# EAGLE design tick-wifi-mk-1.2 (EAGLE 7.5.0)
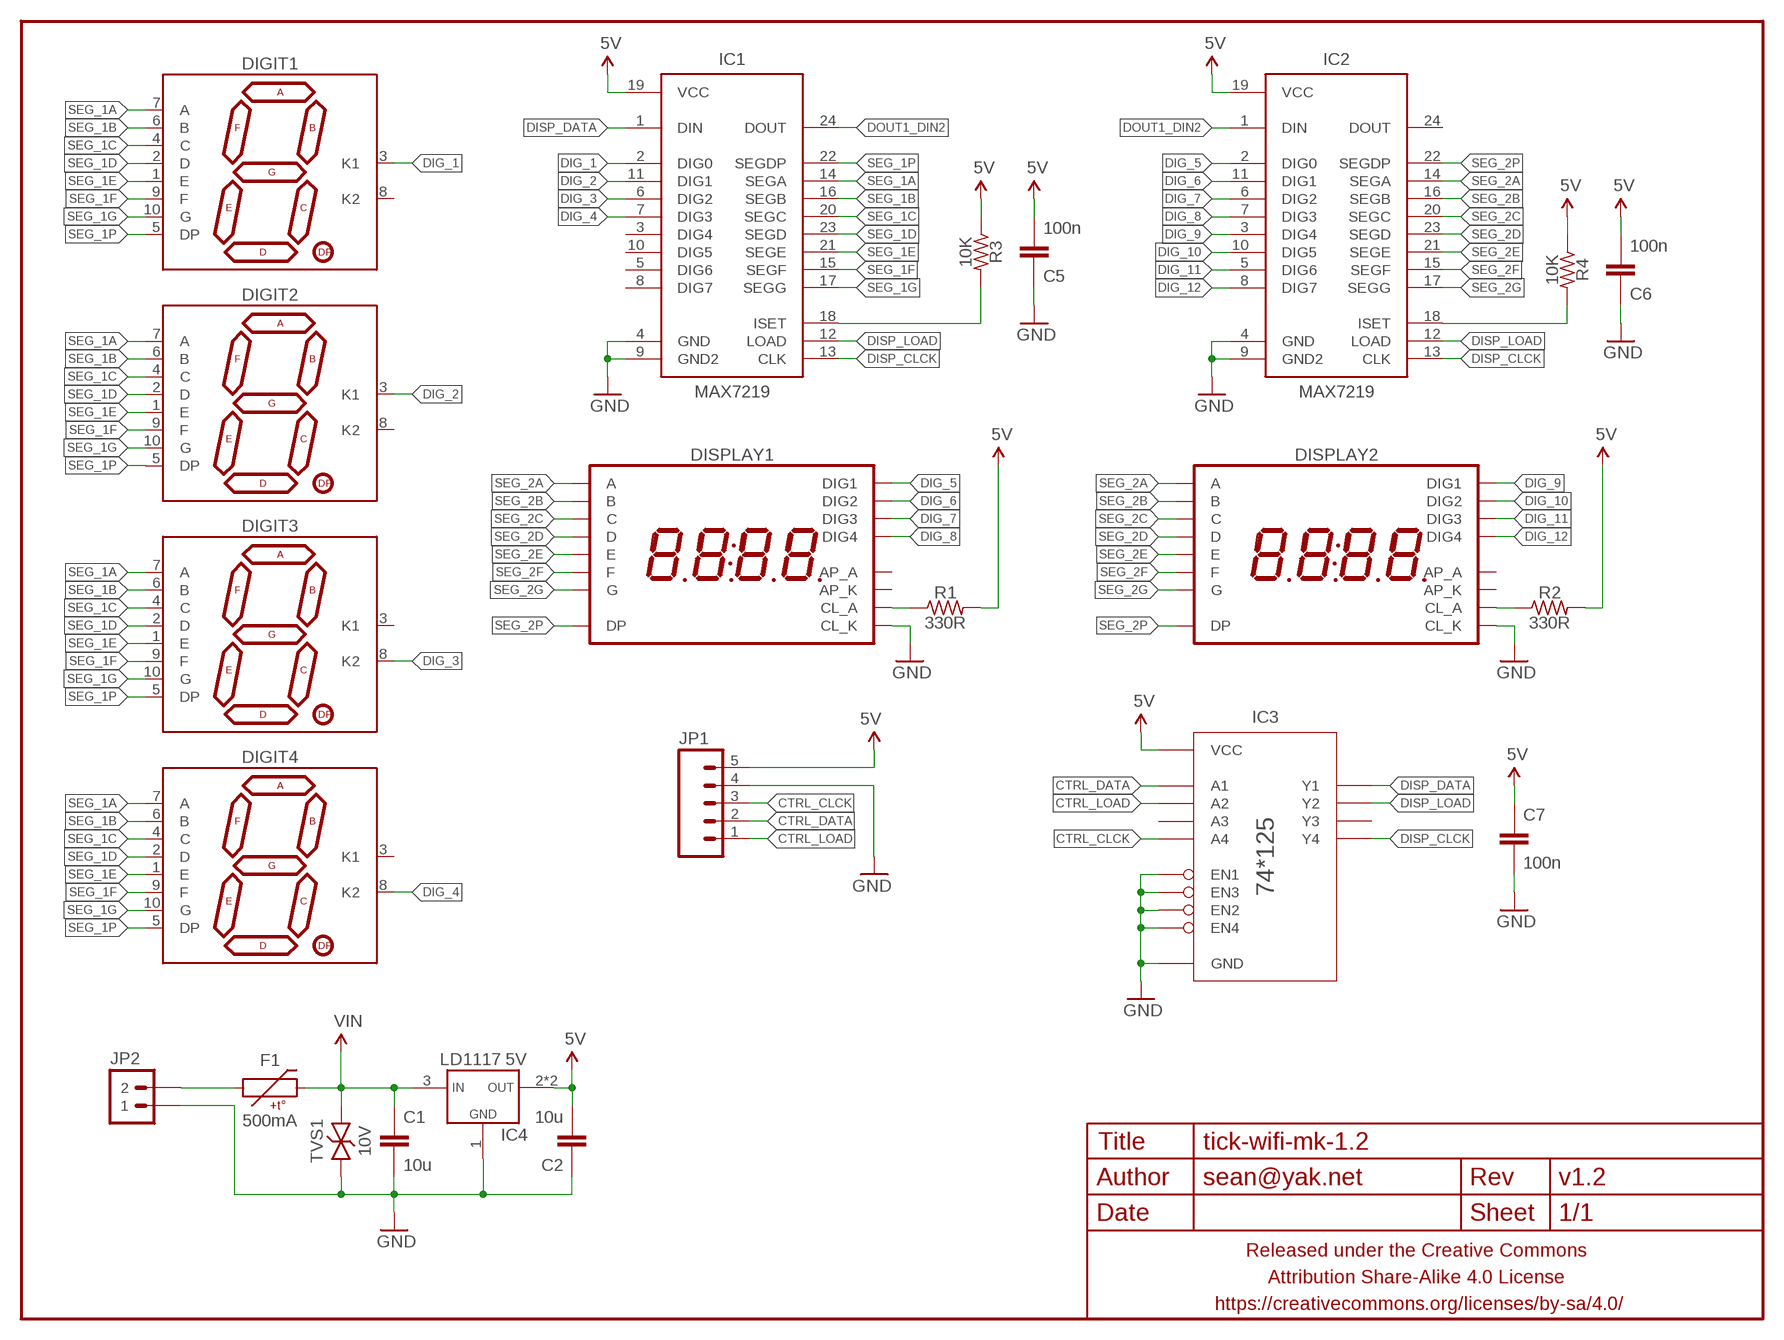
[diagram p0: schematic, sheet 1]

## Parts
C1  10u  CAPACITOR-CERAMICC1210  [C1210]
C2  10u  CAPACITOR-CERAMICC1210  [C1210]
C5  100n  CAPACITOR-CERAMICC0603  [C0603]
C6  100n  CAPACITOR-CERAMICC0603  [C0603]
C7  100n  CAPACITOR-CERAMICC0603  [C0603]
DIGIT1  7SEG_1DIGPTH-25.4MM-BARE  [7SEG_1DIG_25.4MM_NOSILK]
DIGIT2  7SEG_1DIGPTH-25.4MM-BARE  [7SEG_1DIG_25.4MM_NOSILK]
DIGIT3  7SEG_1DIGPTH-25.4MM-BARE  [7SEG_1DIG_25.4MM_NOSILK]
DIGIT4  7SEG_1DIGPTH-25.4MM-BARE  [7SEG_1DIG_25.4MM_NOSILK]
DISPLAY1  7SEG_4DIGIT_COLON_APOS  [7SEG_4DIG_10MM]
DISPLAY2  7SEG_4DIGIT_COLON_APOS  [7SEG_4DIG_10MM]
F1  500mA  PTCPTC-1210  [PTC-1210]
FRAME1  FRAME-LETTERNO_PACKAGE  [DUMMY]
IC1  MAX7219  MAX7219SOIC-W  [SO24W]
IC2  MAX7219  MAX7219SOIC-W  [SO24W]
IC3  74HC125  74125SOIC14  [SO14]
IC4  LD1117 5V  VREG_1117SOT223  [SOT223]
JP1  M05PTH-CENTERED  [1X05_PTH_CENTERED]
JP2  M02PTH-CENTERED-R+  [1X02-CENTER-R+]
R1  330R  RESISTORR0603  [R0603]
R2  330R  RESISTORR0603  [R0603]
R3  10K  RESISTORR0603  [R0603]
R4  10K  RESISTORR0603  [R0603]
TVS1  10V  TVSSMA  [SMA-DIODE-TVS-BIDIR]

## Nets
5V: C2.2 C5.2 C6.2 C7.1 IC1.19(VCC) IC2.19(VCC) IC3.14(VCC) IC4.2(VOUT) IC4.4(VOUT) JP1.5 R1.2 R2.2 R3.1 R4.1
CTRL_CLCK: IC3.12(A4) JP1.3
CTRL_DATA: IC3.2(A1) JP1.2
CTRL_LOAD: IC3.5(A2) JP1.1
DIG_1: DIGIT1.3(K1) IC1.2(DIG0)
DIG_2: DIGIT2.3(K1) IC1.11(DIG1)
DIG_3: DIGIT3.8(K2) IC1.6(DIG2)
DIG_4: DIGIT4.8(K2) IC1.7(DIG3)
DIG_5: DISPLAY1.1(DIG1) IC2.2(DIG0)
DIG_6: DISPLAY1.2(DIG2) IC2.11(DIG1)
DIG_7: DISPLAY1.6(DIG3) IC2.6(DIG2)
DIG_8: DISPLAY1.8(DIG4) IC2.7(DIG3)
DIG_9: DISPLAY2.1(DIG1) IC2.3(DIG4)
DIG_10: DISPLAY2.2(DIG2) IC2.10(DIG5)
DIG_11: DISPLAY2.6(DIG3) IC2.5(DIG6)
DIG_12: DISPLAY2.8(DIG4) IC2.8(DIG7)
DISP_CLCK: IC1.13(CLK) IC2.13(CLK) IC3.11(Y4)
DISP_DATA: IC1.1(DIN) IC3.3(Y1)
DISP_LOAD: IC1.12(LOAD) IC2.12(LOAD) IC3.6(Y2)
DOUT1_DIN2: IC1.24(DOUT) IC2.1(DIN)
GND: C1.2 C2.1 C5.1 C6.1 C7.2 DISPLAY1.12(CL_K) DISPLAY2.12(CL_K) IC1.4(GND) IC1.9(GND2) IC2.4(GND) IC2.9(GND2) IC3.1(EN1) IC3.4(EN2) IC3.7(GND) IC3.10(EN3) IC3.13(EN4) IC4.1(GND) JP1.4 JP2.1 TVS1.1
N$1: F1.1 JP2.2
N$2: IC2.18(ISET) R4.2
N$3: DISPLAY1.4(CL_A) R1.1
N$4: IC1.18(ISET) R3.2
N$5: DISPLAY2.4(CL_A) R2.1
SEG_1A: DIGIT1.7(A) DIGIT2.7(A) DIGIT3.7(A) DIGIT4.7(A) IC1.14(SEGA)
SEG_1B: DIGIT1.6(B) DIGIT2.6(B) DIGIT3.6(B) DIGIT4.6(B) IC1.16(SEGB)
SEG_1C: DIGIT1.4(C) DIGIT2.4(C) DIGIT3.4(C) DIGIT4.4(C) IC1.20(SEGC)
SEG_1D: DIGIT1.2(D) DIGIT2.2(D) DIGIT3.2(D) DIGIT4.2(D) IC1.23(SEGD)
SEG_1E: DIGIT1.1(E) DIGIT2.1(E) DIGIT3.1(E) DIGIT4.1(E) IC1.21(SEGE)
SEG_1F: DIGIT1.9(F) DIGIT2.9(F) DIGIT3.9(F) DIGIT4.9(F) IC1.15(SEGF)
SEG_1G: DIGIT1.10(G) DIGIT2.10(G) DIGIT3.10(G) DIGIT4.10(G) IC1.17(SEGG)
SEG_1P: DIGIT1.5(DP) DIGIT2.5(DP) DIGIT3.5(DP) DIGIT4.5(DP) IC1.22(SEGDP)
SEG_2A: DISPLAY1.14(A) DISPLAY2.14(A) IC2.14(SEGA)
SEG_2B: DISPLAY1.16(B) DISPLAY2.16(B) IC2.16(SEGB)
SEG_2C: DISPLAY1.13(C) DISPLAY2.13(C) IC2.20(SEGC)
SEG_2D: DISPLAY1.3(D) DISPLAY2.3(D) IC2.23(SEGD)
SEG_2E: DISPLAY1.5(E) DISPLAY2.5(E) IC2.21(SEGE)
SEG_2F: DISPLAY1.11(F) DISPLAY2.11(F) IC2.15(SEGF)
SEG_2G: DISPLAY1.15(G) DISPLAY2.15(G) IC2.17(SEGG)
SEG_2P: DISPLAY1.7(DP) DISPLAY2.7(DP) IC2.22(SEGDP)
VIN: C1.1 F1.2 IC4.3(VIN) TVS1.2
Unconnected: DIGIT1.8(K2) DIGIT2.8(K2) DIGIT3.3(K1) DIGIT4.3(K1) DISPLAY1.9(AP_K) DISPLAY1.10(AP_A) DISPLAY2.9(AP_K) DISPLAY2.10(AP_A) IC1.3(DIG4) IC1.5(DIG6) IC1.8(DIG7) IC1.10(DIG5) IC2.24(DOUT) IC3.8(Y3) IC3.9(A3)

## Library data of the parts
C1 C2 C5-C7 = a_parts:CAPACITOR-CERAMIC: CAPACITOR, European symbol
DIGIT1-DIGIT4 = a_parts:7SEG_1DIG
DISPLAY1 DISPLAY2 = a_parts:7SEG_4DIGIT_COLON_APOS
F1 = a_parts:PTC: Resettable Fuse PTC Resettable Fuse. Spark Fun Electronics SKU : COM-08357
FRAME1 = a_parts:FRAME-LETTER: Schematic Frame Standard 8.5x11 US Letter frame; DESIGNER: sean@yak.net; VERSION: v1.2
IC1 IC2 = a_parts:MAX7219: 8-digit, 8-segment LED display driver, serial input
IC3 = a_parts:74*125
IC4 = a_parts:VREG_1117
JP1 = a_parts:M05: Header 5 Standard 5-pin 0.1" header. Use with straight break away headers (SKU : PRT-00116), right angle break away headers (PRT-00553), swiss pins (PRT-00743), machine pins (PRT-00117), and female headers (PRT-00115). Molex polarized connector foot print use with SKU : PRT-08230 with associated crimp pins and housings.
JP2 = a_parts:M02: Standard 2-pin 0.1" header. Use with - straight break away headers ( PRT-00116) - right angle break away headers (PRT-00553) - swiss pins (PRT-00743) - machine pins (PRT-00117) - female headers (PRT-00115) Molex polarized connector foot print use with: PRT-08233 with associated crimp pins and housings. 2.54_SCREWTERM for use with PRT-10571. 3.5mm Screw Terminal footprints for PRT-08084 5mm Screw Terminal footprints for use with PRT-08433
R1-R4 = a_parts:RESISTOR: RESISTOR, American symbol
TVS1 = a_parts:TVS: Transient voltage suppressor- prevents ESD on inputs. Ignore package description- MBRA140 is NOT this type of part!!!

## Board
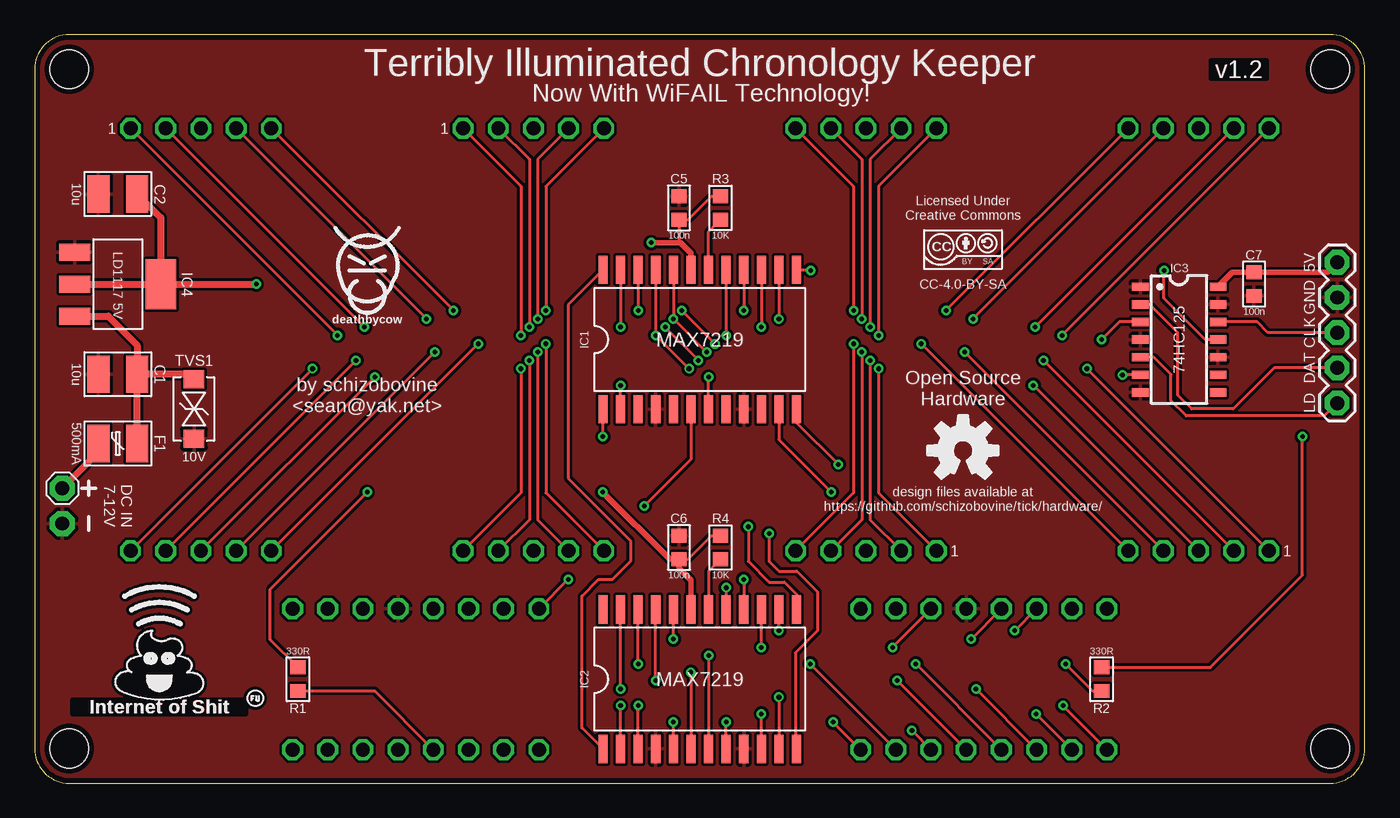
[diagram p1: board, top side]
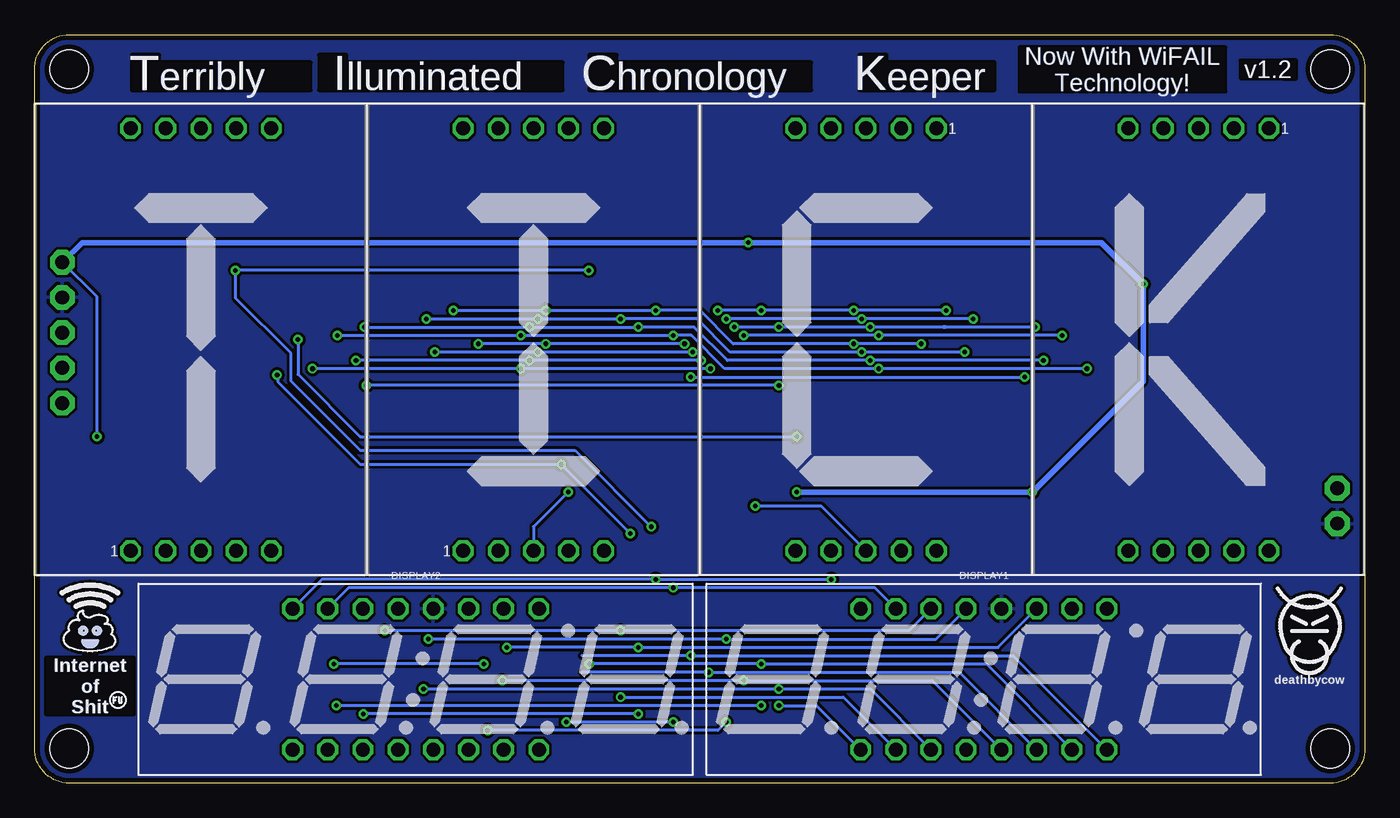
[diagram p2: board, bottom side, seen from below]

Size 96 x 54 mm. Coordinates in mm from the lower left corner, seen from the top.
Outline: 2.5,0 93.5,0 arc90 96,2.5 96,51.5 arc90 93.5,54 2.5,54 arc90 0,51.5 0,2.5 arc90 2.5,0
Copper layers (1*16): Top 0.0356mm / dielectric 1.5011mm / Bottom 0.0356mm
Design rules "LaenPCBOrder_2": minimum track width 6mil, minimum drill 13mil, track to track 6mil, track to pad 6mil, pad to pad 6mil, via to via 6mil, smd to smd 6mil, copper to edge 15mil, drill to drill 6mil, minimum pad ring 7mil, minimum via ring 7mil, stop-mask expansion 3mil, vias tented up to drill 20mil, thermal gap 10mil
Holes 2.8 mm at 2.5,2.5 93.5,2.5 2.5,51.5 93.5,51.5

### Footprints (pad centres in the part's own frame; a part is rotated, then mirrored left to right if it is on the bottom)
C1210 = smd 1.6 x 2.7: 1 -1.4,0; 2 1.4,0
C0603 = smd 1 x 1.1: 1 -0.85,0; 2 0.85,0
7SEG_1DIG_25.4MM_NOSILK = drill 1 pad 1.5 octagon: 1 -5.08,-15.24; 2 -2.54,-15.24; 3 0,-15.24; 4 2.54,-15.24; 5 5.08,-15.24; 6 5.08,15.24; 7 2.54,15.24; 8 0,15.24; 9 -2.54,15.24; 10 -5.08,15.24
7SEG_4DIG_10MM = drill 1 octagon: 1 -8.89,-5.08; 2 -6.35,-5.08; 3 -3.81,-5.08; 4 -1.27,-5.08; 5 1.27,-5.08; 6 3.81,-5.08; 7 6.35,-5.08; 8 8.89,-5.08; 9 8.89,5.08; 10 6.35,5.08; 11 3.81,5.08; 12 1.27,5.08; 13 -1.27,5.08; 14 -3.81,5.08; 15 -6.35,5.08; 16 -8.89,5.08
PTC-1210 = smd 1.6 x 2.7: 1 -1.4,0; 2 1.4,0
SO24W = smd 0.66 x 2.032: 1 -6.985,-5.029; 2 -5.715,-5.029; 3 -4.445,-5.029; 4 -3.175,-5.029; 5 -1.905,-5.029; 6 -0.635,-5.029; 7 0.635,-5.029; 8 1.905,-5.029; 9 3.175,-5.029; 10 4.445,-5.029; 11 5.715,-5.029; 12 6.985,-5.029; 13 6.985,5.029; 14 5.715,5.029; 15 4.445,5.029; 16 3.175,5.029; 17 1.905,5.029; 18 0.635,5.029; 19 -0.635,5.029; 20 -1.905,5.029; 21 -3.175,5.029; 22 -4.445,5.029; 23 -5.715,5.029; 24 -6.985,5.029
SO14 = smd 0.6 x 1.2: 1 -3.81,-2.8; 2 -2.54,-2.8; 3 -1.27,-2.8; 4 0,-2.8; 5 1.27,-2.8; 6 2.54,-2.8; 7 3.81,-2.8; 8 3.81,2.8; 9 2.54,2.8; 10 1.27,2.8; 11 0,2.8; 12 -1.27,2.8; 13 -2.54,2.8; 14 -3.81,2.8
SOT223 = smd 1.219 x 2.235: 1 -2.311,-3.099; 2 0,-3.099; 3 2.311,-3.099 | smd 3.6 x 2.2: 4 0,3.099
1X05_PTH_CENTERED = drill 1 pad 1.778 octagon: 1 -5.08,0; 2 -2.54,0; 3 0,0; 4 2.54,0; 5 5.08,0
1X02-CENTER-R+ = drill 1 pad 1.8 octagon: 1 -1.27,0; 2 1.27,0
R0603 = smd 1 x 1.1: 1 -0.85,0; 2 0.85,0
SMA-DIODE-TVS-BIDIR = smd 1.3 x 1.5: 1 -2.15,0; 2 2.15,0

### Placement (x,y rotation side)
C1  6,29.5 180 top
C2  6,42.5 0 top
C5  46.5,41.5 270 top
C6  46.5,17 270 top
C7  88,36 270 top
DIGIT1  84,32 0 bottom
DIGIT2  60,32 0 bottom
DIGIT3  36,32 180 bottom
DIGIT4  12,32 180 bottom
DISPLAY1  27.5,7.5 0 bottom
DISPLAY2  68.5,7.5 0 bottom
F1  6,24.5 0 top
FRAME1  0,-0.5 0 top
IC1  48,32 0 top
IC2  48,7.5 0 top
IC3  82.6,32 270 top
IC4  6,36 270 top
JP1  94,32.5 90 top
JP2  2,20 90 top
R1  19,7.5 90 top
R2  77,7.5 90 top
R3  49.5,41.5 270 top
R4  49.5,17 270 top
TVS1  11.5,27 90 top
U$1  [TICK_SYMBOL]  48,32 0 bottom
U$2  [COW_SMALL]  24,37.5 0 top
U$3  [INTERNET_OF_SHIT_TEXT_METAL]  9,8.5 0 top
U$4  [INTERNET_OF_SHIT_TEXT]  9,8.5 0 top
U$5  [COW_SMALL]  4,11.5 0 bottom
U$6  [CC-BY-SA-4.0-NO-URL]  67,38.5 0 top
U$7  [OSHWLOGO_SILKONLY]  67,24 0 top
U$8  [INTERNET_OF_SHIT_JR_METAL]  92,11 0 bottom
U$9  [COW_SMALL_METAL_NOTEXT]  4,11.5 0 bottom
U$10  [F_YOU_MARK_METAL]  90,6 0 bottom

### Tracks (layer width: path | path; a pad name or v marks a point on that pad's centre or on a via)
5V  (via drill 0.33)
  Top 0.2: C6.2 47.15,16.15 48.85,17.85 R4.1 | R3.1 48.85,42.35 47.15,40.65 C5.2 46.5,39 | v24,21 17,14 17,10.35 R1.2 | R2.2 84.85,8.35 91.5,15 v91.5,25
  Top 0.406: IC3.14 86.44,36.85 C7.1 93.27,36.85 JP1.5 | IC2.19 47.37,14.63 46.5,15.5 C6.2 45.85,16.15 v41,21 | v44.5,39 46.5,39 46.6,39 47.37,38.23 IC1.19
  Top 0.5: IC4.2 IC4.4 | IC4.4 v16,36 | C2.2 9.1,40.8 IC4.4
  Bottom 0.2: v91.5,25 91.5,35.08 JP1.5
  Bottom 0.406: JP1.5 92.58,39 v44.5,39 19,39 v16,36 16,29 v24,21 v41,21
CTRL_CLCK
  Top 0.2: JP1.3 89,32.5 88.23,33.27 IC3.12
CTRL_DATA
  Top 0.2: JP1.2 89.46,29.96 86.5,27 83.5,27 82.5,28 82.5,32.5 80.46,34.54 IC3.2
CTRL_LOAD
  Top 0.2: JP1.1 93.08,26.5 83.1,26.5 82,27.6 82,29.5 80.77,30.73 IC3.5
DIG_1  (via drill 0.33)
  Top 0.2: IC1.2 v42.28,28.7 | v72.06,28.7 DIGIT1.3
  Bottom 0.2: v42.28,28.7 v72.06,28.7
DIG_2  (via drill 0.33)
  Top 0.2: IC1.11 53.72,24.79 v57.5,21
  Bottom 0.2: v57.5,21 60,18.5 DIGIT2.3
DIG_3  (via drill 0.33)
  Top 0.2: IC1.6 47.37,23.36 v44,20
  Bottom 0.2: v44,20 39.24,20 DIGIT3.8
DIG_4  (via drill 0.33)
  Top 0.2: IC1.7 v48.63,29.3 | v24.54,29.3 DIGIT4.8
  Bottom 0.2: v48.63,29.3 v24.54,29.3
DIG_5  (via drill 0.33)
  Top 0.2: IC2.2 v42.28,5.6
  Bottom 0.2: v42.28,5.6 39.57,5.6 DISPLAY1.1
DIG_6  (via drill 0.33)
  Top 0.2: v53.72,6.2 IC2.11
  Bottom 0.2: v53.72,6.2 37.63,6.2 DISPLAY1.2
DIG_7  (via drill 0.33)
  Top 0.2: v47.37,8 IC2.6
  Bottom 0.2: 56.5,8 v47.37,8 29.27,8 DISPLAY1.6
DIG_8  (via drill 0.33)
  Top 0.2: v48.63,9.2 IC2.7
  Bottom 0.2: 56.5,9.2 v48.63,9.2 25.39,9.2 DISPLAY1.8
DIG_9  (via drill 0.33)
  Top 0.2: v74.21,5.6 DISPLAY2.1 | IC2.3 v43.55,5.6
  Bottom 0.2: v43.55,5.6 v74.21,5.6
DIG_10  (via drill 0.33)
  Top 0.2: v72.27,5 DISPLAY2.2 | IC2.10 v52.45,5
  Bottom 0.2: v52.45,5 v72.27,5
DIG_11  (via drill 0.33)
  Top 0.2: v63.31,3.8 DISPLAY2.6 | IC2.5 v46.09,4.4
  Bottom 0.2: v46.09,4.4 46.7,3.8 v63.31,3.8
DIG_12  (via drill 0.33)
  Top 0.2: v57.63,4.4 DISPLAY2.8 | IC2.8 v49.91,4.4
  Bottom 0.2: v49.91,4.4 v57.63,4.4
DISP_CLCK  (via drill 0.33)
  Top 0.2: IC3.11 84.5,32 81.5,35 v81.5,37 | v56,37 55.01,37 IC1.13 | v51.5,18.5 51.5,16 53,14.5 54.1,14.5 55,13.6 55,12.54 IC2.13
  Bottom 0.2: v56,37 v81.5,37 81.5,35 77.5,31 77.5,29 72.5,24 57,24 v51.5,18.5
DISP_DATA  (via drill 0.33)
  Top 0.2: IC3.3 78.27,33.27 v77,32 | v41.02,25 IC1.1
  Bottom 0.2: v77,32 77,29.5 72.5,25 v41.02,25
DISP_LOAD  (via drill 0.33)
  Top 0.2: IC3.6 v78.5,29.46 | IC1.12 54.98,26.02 v58,23 | v53,18 53,16 53.7,15.3 55,15.3 56.5,13.8 56.5,11 54.9,9.4 54.9,2.56 IC2.12
  Bottom 0.2: v78.5,29.46 78.46,29.46 78.46,28.96 72.5,23 v58,23 v53,18
DOUT1_DIN2
  Top 0.2: IC1.24 38.5,34.51 38.5,22 43,17.5 43,16 41.7,14.7 40.7,14.7 39.5,13.5 39.5,3.99 IC2.1
GND
  pour Top (isolate 0.2): 2.5,54 93.5,54 arc-90 96,51.5 96,2.5 arc-90 93.5,0 2.5,0 arc-90 0,2.5 0,51.5 arc-90
  pour Bottom (isolate 0.2): 2.5,54 93.5,54 arc-90 96,51.5 96,2.5 arc-90 93.5,0 2.5,0 arc-90 0,2.5 0,51.5 arc-90
  pour Bottom: 6,49 90,49 90,54 6,54
N$1
  Top 0.5: JP2.2 4.6,23.87 F1.1
N$2
  Top 0.2: R4.2 48.63,15.29 IC2.18
N$3
  Top 0.2: R1.1 24.54,6.65 DISPLAY1.4
N$4
  Top 0.2: IC1.18 48.63,39.78 R3.2
N$5  (via drill 0.33)
  Top 0.2: DISPLAY2.4 v63.59,8.6 | v74.4,8.6 76.35,6.65 R2.1
  Bottom 0.2: v63.59,8.6 v74.4,8.6
SEG_1A  (via drill 0.33)
  Top 0.2: IC1.14 v53.72,33.5 | DIGIT4.7 v28.88,31.1 | DIGIT1.7 v67.72,33.5 | DIGIT2.7 59.7,45 v59.7,33.5 | v36.3,31.1 36.3,19 DIGIT3.7
  Bottom 0.2: v28.88,31.1 v36.3,31.1 45.8,31.1 48.2,33.5 v53.72,33.5 v59.7,33.5 v67.72,33.5
SEG_1B  (via drill 0.33)
  Top 0.2: IC1.16 v51.17,34.1 | DIGIT4.6 v32.02,31.7 | DIGIT1.6 v65.78,34.1 | DIGIT2.6 59.1,43.06 v59.1,34.1 | v36.9,31.7 36.9,20.94 DIGIT3.6
  Bottom 0.2: v32.02,31.7 v36.9,31.7 45.6,31.7 48,34.1 v51.17,34.1 v59.1,34.1 v65.78,34.1
SEG_1C  (via drill 0.33)
  Top 0.2: IC1.20 v46.09,33.5 v48.49,31.1 | DIGIT4.4 v28.28,33.5 | DIGIT3.4 36.3,45 v36.3,33.5 | v67.12,31.1 DIGIT1.4 | v59.7,31.1 59.7,19 DIGIT2.4
  Bottom 0.2: v28.28,33.5 v36.3,33.5 v46.09,33.5 | v48.49,31.1 v59.7,31.1 v67.12,31.1
SEG_1D  (via drill 0.33)
  Top 0.2: IC1.23 v42.28,32.9 | DIGIT4.2 v23.8,32.9 | DIGIT3.2 35.7,45 v35.7,32.9 | v45.5,32.9 v47.9,30.5 | v72.8,30.5 DIGIT1.2 | v60.3,30.5 60.3,19 DIGIT2.2
  Bottom 0.2: 30.4,32.9 v35.7,32.9 v42.28,32.9 v45.5,32.9 | v23.8,32.9 30.3,32.9 | v47.9,30.5 v60.3,30.5 v72.8,30.5
  Bottom 0.3: 30.3,32.9 30.4,32.9
SEG_1E  (via drill 0.33)
  Top 0.2: IC1.21 v44.83,32.3 v47.23,29.9 | DIGIT4.1 v21.86,32.3 | DIGIT3.1 35.1,43.06 v35.1,32.3 | v75.94,29.9 DIGIT1.1 | v60.9,29.9 60.9,20.94 DIGIT2.1
  Bottom 0.2: v21.86,32.3 v35.1,32.3 v44.83,32.3 | v47.23,29.9 v60.9,29.9 v75.94,29.9
SEG_1F  (via drill 0.33)
  Top 0.2: IC1.15 v52.45,32.9 | DIGIT4.9 v23.2,30.5 | DIGIT1.9 v72.2,32.9 | DIGIT2.9 60.3,45 v60.3,32.9 | v35.7,30.5 35.7,19 DIGIT3.9
  Bottom 0.2: v23.2,30.5 v35.7,30.5 46,30.5 48.4,32.9 v52.45,32.9 v60.3,32.9 v72.2,32.9
SEG_1G  (via drill 0.33)
  Top 0.2: IC1.17 v49.91,32.3 | DIGIT4.10 v20.06,29.9 | DIGIT1.10 v74.14,32.3 | DIGIT2.10 60.9,43.06 v60.9,32.3 | v35.1,29.9 35.1,20.94 DIGIT3.10
  Bottom 0.2: v20.06,29.9 v35.1,29.9 46.2,29.9 48.6,32.3 v49.91,32.3 v60.9,32.3 v74.14,32.3
SEG_1P  (via drill 0.33)
  Top 0.2: IC1.22 v43.55,34.1 | DIGIT4.5 v30.22,34.1 | DIGIT3.5 36.9,43.06 v36.9,34.1 | v46.7,34.1 v49.1,31.7 | v63.98,31.7 DIGIT1.5 | v59.1,31.7 59.1,20.94 DIGIT2.5
  Bottom 0.2: 30.5,34.1 v36.9,34.1 v43.55,34.1 v46.7,34.1 | v49.1,31.7 v59.1,31.7 v63.98,31.7
  Bottom 0.3: v30.22,34.1 30.5,34.1
SEG_2A  (via drill 0.33)
  Top 0.2: v70.73,11 DISPLAY2.14 | v53.72,11 IC2.14
  Bottom 0.2: v70.73,11 v53.72,11 32.89,11 DISPLAY1.14
SEG_2B  (via drill 0.33)
  Top 0.2: v38.51,14.7 DISPLAY1.16 | v51.17,14.7 IC2.16
  Bottom 0.2: v38.51,14.7 v51.17,14.7 75.27,14.7 DISPLAY2.16
SEG_2C  (via drill 0.33)
  Top 0.2: v67.59,10.4 DISPLAY2.13 | v46.09,10.4 IC2.20
  Bottom 0.2: v67.59,10.4 v46.09,10.4 30.95,10.4 DISPLAY1.13
SEG_2D  (via drill 0.33)
  Top 0.2: v67.93,6.8 DISPLAY2.3 | v42.28,6.8 IC2.23
  Bottom 0.2: v67.93,6.8 v42.28,6.8 35.69,6.8 DISPLAY1.3
SEG_2E  (via drill 0.33)
  Top 0.2: v62.25,7.4 DISPLAY2.5 | v44.83,7.4 IC2.21
  Bottom 0.2: v62.25,7.4 v44.83,7.4 31.21,7.4 DISPLAY1.5
SEG_2F  (via drill 0.33)
  Top 0.2: v61.91,9.8 DISPLAY2.11 | v52.45,9.8 IC2.15
  Bottom 0.2: v61.91,9.8 v52.45,9.8 26.47,9.8 DISPLAY1.11
SEG_2G  (via drill 0.33)
  Top 0.2: v49.91,14.1 IC2.17
  Bottom 0.2: DISPLAY2.15 73.33,14.1 v49.91,14.1 35.37,14.1 DISPLAY1.15
SEG_2P  (via drill 0.33)
  Top 0.2: v55.97,8.6 DISPLAY2.7 | v43.55,8.6 IC2.22
  Bottom 0.2: v55.97,8.6 v43.55,8.6 27.33,8.6 DISPLAY1.7
VIN
  Top 0.5: F1.2 C1.1 | TVS1.2 11.15,29.5 C1.1 | IC4.3 5.31,33.69 7.4,31.6 C1.1

### Text on the board
Bottom: Now With WiFAIL / Technology! | K | eeper | C | hronology | I | lluminated | T | erribly | Internet / of / Shit
tPlace: Terribly Illuminated Chronology Keeper | Now With WiFAIL Technology! | Licensed Under / Creative Commons | CC-4.0-BY-SA | by schizobovine / <sean@yak.net> | Open Source / Hardware | DC IN / 7-12V | design files available at / https://github.com/schizobovine/tick/hardware/
bPlace: Now With WiFAIL / Technology! | K | eeper | C | hronology | I | lluminated | T | erribly | Internet / of / Shit
tNames: 5V | GND | CLK | DAT | LD